# EAGLE design power_test (EAGLE 9.0.0)
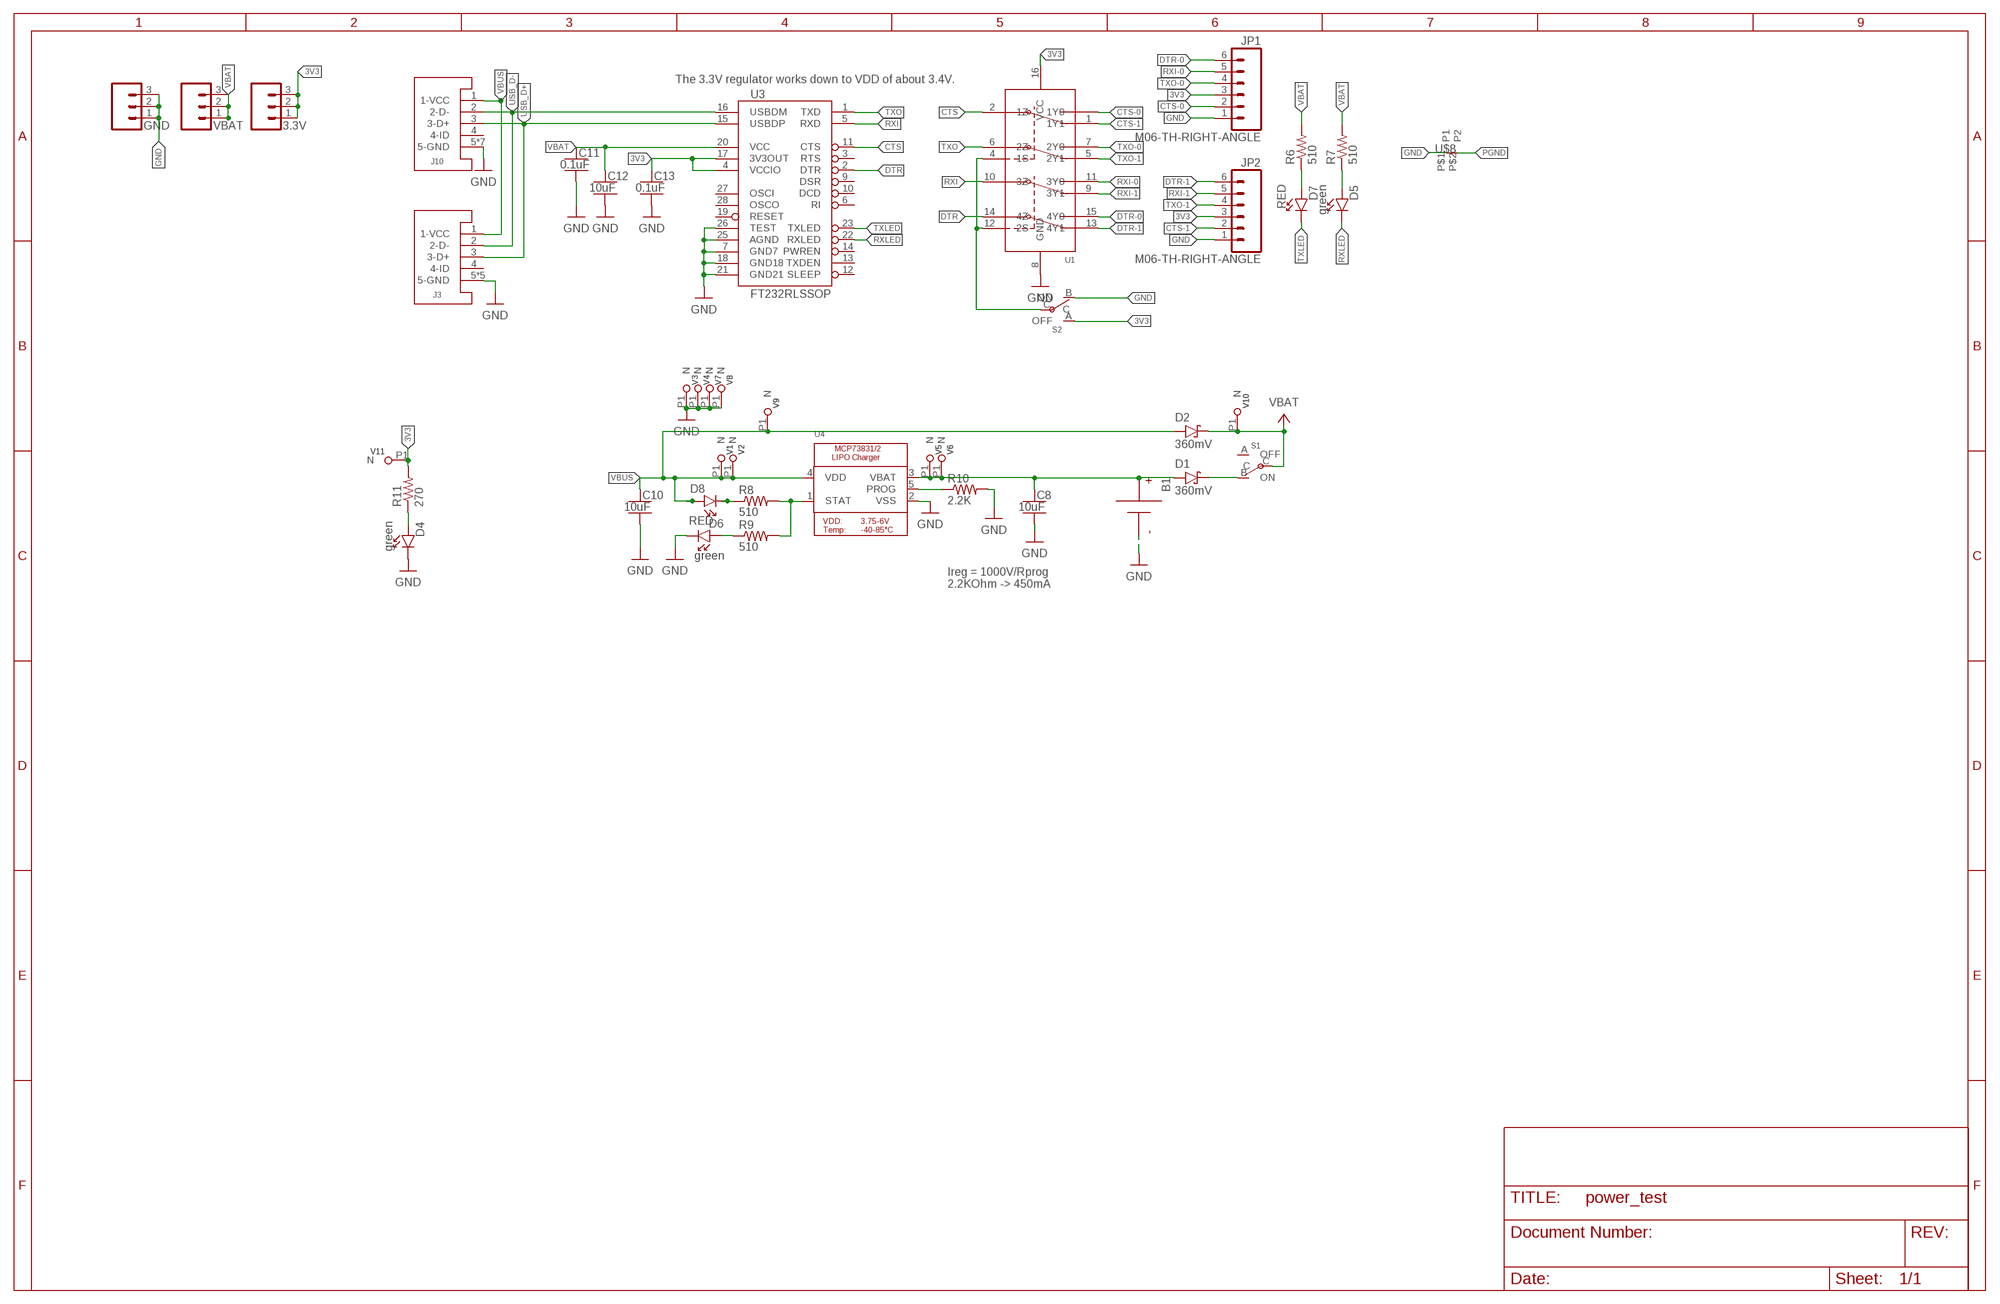
[diagram p0: schematic, sheet 1]
FRAME1 (FRAME_B_L): CREATOR: Unknown; DIST: Unknown; DISTPN: Unknown

## Parts
3.3V  HEADER-0.1IN-3POS-MALE  [HDRV3W63P254_3X1_762X254H838_HS]
B1  BATTERY  [BATTERY-TERMINALS]
C8  10uF  CAPACITOR-NP_SMD-2012-0805_CERAMIC-10UF  [CAPC2012X140_HS]
C10  10uF  CAPACITOR-NP_SMD-2012-0805_CERAMIC-10UF  [CAPC2012X140_HS]
C11  0.1uF  CAPACITOR-NP_SMD-2012-0805_CERAMIC-0.1UF  [CAPC2012X140_HS]
C12  10uF  CAPACITOR-NP_SMD-2012-0805_CERAMIC-10UF  [CAPC2012X140_HS]
C13  0.1uF  CAPACITOR-NP_SMD-2012-0805_CERAMIC-0.1UF  [CAPC2012X140_HS]
D1  360mV  DIODE-SCHOTTKY_SMD-SOD123-360MV  [SOD3716X135_HS]
D2  360mV  DIODE-SCHOTTKY_SMD-SOD123-360MV  [SOD3716X135_HS]
D4  green  DIODE-LED_SMD-2012-0805-GREEN  [LEDSC125X200X120-2_HS]
D5  green  DIODE-LED_SMD-2012-0805-GREEN  [LEDSC125X200X120-2_HS]
D6  green  DIODE-LED_SMD-2012-0805-GREEN  [LEDSC125X200X120-2_HS]
D7  RED  DIODE-LED_SMD-2012-0805-RED  [LEDSC125X200X120-2_HS]
D8  RED  DIODE-LED_SMD-2012-0805-RED  [LEDSC125X200X120-2_HS]
GND  HEADER-0.1IN-3POS-MALE  [HDRV3W63P254_3X1_762X254H838_HS]
J3  USB-MICROB-EDAC-690-005-299-043  [USB-MINIB-EDAC-690-005-299-043]
J10  USB-MICROA-AMPHENOL-10118192-0001LF  [USB-MICROA-10118192-0001LF]
JP1  M06-TH-RIGHT-ANGLE  [1X06-SIP-RIGHT-ANGLE]
JP2  M06-TH-RIGHT-ANGLE  [1X06-SIP-RIGHT-ANGLE]
R6  510  RESISTOR_SMD-2012-0805-510  [RESC2012X60_HS]
R7  510  RESISTOR_SMD-2012-0805-510  [RESC2012X60_HS]
R8  510  RESISTOR_SMD-2012-0805-510  [RESC2012X60_HS]
R9  510  RESISTOR_SMD-2012-0805-510  [RESC2012X60_HS]
R10  2.2K  RESISTOR_SMD-2012-0805-2.2K  [RESC2012X60_HS]
R11  270  RESISTOR_SMD-2012-0805-270  [RESC2012X60_HS]
S1  POWER-SWITCH-MFS201N-9-ZJS102011SAQN  [JS102011SAQN]
S2  POWER-SWITCH-MFS201N-9-ZJS102011SAQN  [JS102011SAQN]
U1  DPDT-X2  [SOP65P640X110-16]
U3  FT232RLSSOP  [SSOP28DB]
U4  MCP73831T-2ACI/OT  MCP73831/2  [SOT23-5]
U$8  NET_BRIDGE  [NET_BRIDGE]
V1  LOCKED-VIA-0.2  [VIA-0.2MM]
V2  LOCKED-VIA-0.2  [VIA-0.2MM]
V3  LOCKED-VIA-0.2  [VIA-0.2MM]
V4  LOCKED-VIA-0.2  [VIA-0.2MM]
V5  LOCKED-VIA-0.2  [VIA-0.2MM]
V6  LOCKED-VIA-0.2  [VIA-0.2MM]
V7  LOCKED-VIA-0.2  [VIA-0.2MM]
V8  LOCKED-VIA-0.2  [VIA-0.2MM]
V9  LOCKED-VIA-0.2  [VIA-0.2MM]
V10  LOCKED-VIA-0.2  [VIA-0.2MM]
V11  LOCKED-VIA-0.2  [VIA-0.2MM]
VBAT  HEADER-0.1IN-3POS-MALE  [HDRV3W63P254_3X1_762X254H838_HS]

## Nets
3V3 [HIGH-I]: 3.3V.1 3.3V.2 3.3V.3 C13.1 JP1.3 JP2.3 R11.2 S2.A(OFF) U1.16(VCC) U3.4(VCCIO) U3.17(3V3OUT) V11.P1(N)
BPOS [HIGH-I]: B1.+(P) C8.1 D1.A U4.3(VBAT) V5.P1(N) V6.P1(N)
CTS: U1.2(1Z) U3.11(CTS)
CTS-0: JP1.2 U1.3(1Y0)
CTS-1: JP2.2 U1.1(1Y1)
DTR: U1.14(4Z) U3.2(DTR)
DTR-0: JP1.6 U1.15(4Y0)
DTR-1: JP2.6 U1.13(4Y1)
GND [HIGH-I]: B1.-(N) C8.2 C10.2 C11.2 C12.2 C13.2 D4.C D6.C GND.1 GND.2 GND.3 J3.5(5-GND) J3.P6(5-GND) J3.P7(5-GND) J3.P8(5-GND) J3.P9(5-GND) J10.5(5-GND) J10.6(5-GND) J10.7(5-GND) J10.8(5-GND) J10.9(5-GND) J10.10(5-GND) J10.11(5-GND) JP1.1 JP2.1 R10.2 S2.B(ON) U1.8(GND) U3.7(GND7) U3.18(GND18) U3.21(GND21) U3.25(AGND) U3.26(TEST) U4.2(VSS) U$8.P$1(P1) V3.P1(N) V4.P1(N) V7.P1(N) V8.P1(N)
N$2: D7.A R6.1
N$3: D5.A R7.1
N$6: D8.C R8.1
N$11: R8.2 R9.2 U4.1(STAT)
N$12: R10.1 U4.5(PROG)
N$13: D6.A R9.1
N$14: D4.A R11.1
N$15 [HIGH-I]: D1.C S1.B(ON)
PGND: U$8.P$2(P2)
PROG_SEL: S2.C U1.4(1S) U1.12(2S)
RXI: U1.10(3Z) U3.5(RXD)
RXI-0: JP1.5 U1.11(3Y0)
RXI-1: JP2.5 U1.9(3Y1)
RXLED: D5.C U3.22(RXLED)
TXLED: D7.C U3.23(TXLED)
TXO: U1.6(2Z) U3.1(TXD)
TXO-0: JP1.4 U1.7(2Y0)
TXO-1: JP2.4 U1.5(2Y1)
USB_D+: J3.3(3-D+) J10.3(3-D+) U3.15(USBDP)
USB_D-: J3.2(2-D-) J10.2(2-D-) U3.16(USBDM)
VBAT [HIGH-I]: C11.1 C12.1 D2.C R6.2 R7.2 S1.C U3.20(VCC) V10.P1(N) VBAT.1 VBAT.2 VBAT.3
VBUS [HIGH-I]: C10.1 D2.A D8.A J3.1(1-VCC) J10.1(1-VCC) U4.4(VDD) V1.P1(N) V2.P1(N) V9.P1(N)
Unconnected: J3.4(4-ID) J10.4(4-ID) S1.A(OFF) U3.3(RTS) U3.6(RI) U3.9(DSR) U3.10(DCD) U3.12(SLEEP) U3.13(TXDEN) U3.14(PWREN) U3.19(RESET) U3.27(OSCI) U3.28(OSCO)

## Notes on the sheet
- The 3.3V regulator works down to VDD of about 3.4V.
- Ireg = 1000V/Rprog
  2.2KOhm -> 450mA

## Library data of the parts
3.3V GND VBAT = Components:HEADER-0.1IN-3POS: 3 pin single inline pin header, socket, or connector; DIST: Digikey; DISTPN: 3M9448-ND
B1 = quadparts_prebuilt:BATTERY; CREATOR: Swanson; DIST: NA; DISTPN: NA
C8 C10 C12 = quadparts_prebuilt:CAPACITOR-NP_: Nonpolarized capacitor; CREATOR: Swanson; DIST: Digikey; DISTPN: 445-14387-1-ND; MFR: TDK Corporation; MPN: C2012X5R1E106K085AC; REVIEWER: Swanson
C11 C13 = quadparts_prebuilt:CAPACITOR-NP_: Nonpolarized capacitor; CREATOR: Swanson; DIST: Digikey; DISTPN: 445-1418-1-ND; MFR: TDK; MPN: C2012X7R2A104K125AA; REVIEWER: Swanson
D1 D2 = quadparts_prebuilt:DIODE-SCHOTTKY_: Schottky diode; CREATOR: Swanson; DIST: Digikey; DISTPN: CRS08QMCT-ND; MFR: Toshiba Semiconductor and Storage; MPN: CRS08(TE85L,Q,M); REVIEWER: Swanson
D4-D6 = RemoteParts:DIODE-LED_: Light emitting diode; CREATOR: Swanson; DIST: Digikey; DISTPN: 160-1179-1-ND; MFR: Lite-On Inc; MPN: LTST-C170GKT; REVIEWER: Swanson
D7 D8 = RemoteParts:DIODE-LED_: Light emitting diode; CREATOR: Swanson; DIST: DIGIKEY; DISTPN: 160-1176-1-ND
J3 = RemoteParts:USB; CREATOR: Swanson; DIST: DIGIKEY; DISTPN: 151-1206-1-ND
J10 = RemoteParts:USB; CREATOR: Swanson; DIST: DIGIKEY; DISTPN: 609-4613-1-ND
JP1 JP2 = RemoteParts:M06: Header 6 Standard 6-pin 0.1" header. Use with straight break away headers (SKU : PRT-00116), right angle break away headers (PRT-00553), swiss pins (PRT-00743), machine pins (PRT-00117), and female headers (PRT-00115). Molex polarized connector foot print use with SKU : PRT-08094 with associated crimp pins and housings. NOTES ON THE VARIANTS LOCK and LOCK_LONGPADS... This footprint was designed to help hold the alignment of a through-hole component (i.e. 6-pin header) while soldering it into place. You may notice that each hole has been shifted either up or down by 0.005 of an inch from it's more standard position (which is a perfectly straight line). This slight alteration caused the pins (the squares in the middle) to touch the edges of the holes. Because they are alternating, it causes a "brace" to hold the component in place. 0.005 has proven to be the perfect amount of "off-center" position when using our standard breakaway headers. Although looks a little odd when you look at the bare footprint, once you have a header in there, the alteration is very hard to notice. Also, if you push a header all the way into place, it is covered up entirely on the bottom side. This idea of altering the position of holes to aid alignment will be further integrated into the Sparkfun Library for other footprints. It can help hold any component with 3 or more connection pins.
R6-R9 = quadparts_prebuilt:RESISTOR_: Resistor; DIST: DIGIKEY; DISTPN: 311-510ARCT-ND
R10 = quadparts_prebuilt:RESISTOR_: Resistor; DIST: DIGIKEY; DISTPN: YAG3776CT-ND
R11 = quadparts_prebuilt:RESISTOR_: Resistor; DIST: DIGIKEY; DISTPN: 311-270ARCT-ND
S1 S2 = RemoteParts:POWER-SWITCH-MFS201N-9-Z; CREATOR: Swanson; DIST: DIGIKEY; DISTPN: 401-1999-1-ND
U1 = RemoteParts:DPDT-X2; CREATOR: Swanson; DIST: DIGIKEY; DISTPN: 568-5300-1-ND
U3 = RemoteParts:FT232RL: USB UART FT232RL 4th Generation USB UART (USB <-> Serial) Controller. Spark Fun Electronics SKU : COM-00650; CREATOR: Swanson; DIST: DIGIKEY; DISTPN: 768-1007-1-ND
U4 = RemoteParts:MCP73831/2: MCP73831/2 LIPO Charger VDD: 3.75 - 6V Temp -40 - 85°C Programmable Charge Rate: 15-500mA NOTE: STAT is a tri-state logic output on the MCP73831 and an open-drain output on the MCP73832. SOT23-5 with 4.2V output and tri-state logic on STAT = MCP73831T-2ACI/OT; CREATOR: Adafruit; DIST: DIGIKEY; DISTPN: MCP73831T-2ACI/OTCT-ND
U$8 = custom:NET_BRIDGE; CREATOR: Michael Gonzalez; DIST: Nobody; DISTPN: 0; MFR: Digikey; MPN: 0
V1-V11 = quadparts_prebuilt:LOCKED-VIA; CREATOR: Swanson; DIST: NA; DISTPN: NA

## Net classes
1 HIGH-I: width 0.381 mm
2 RFSIG: width 0.457 mm

## Board
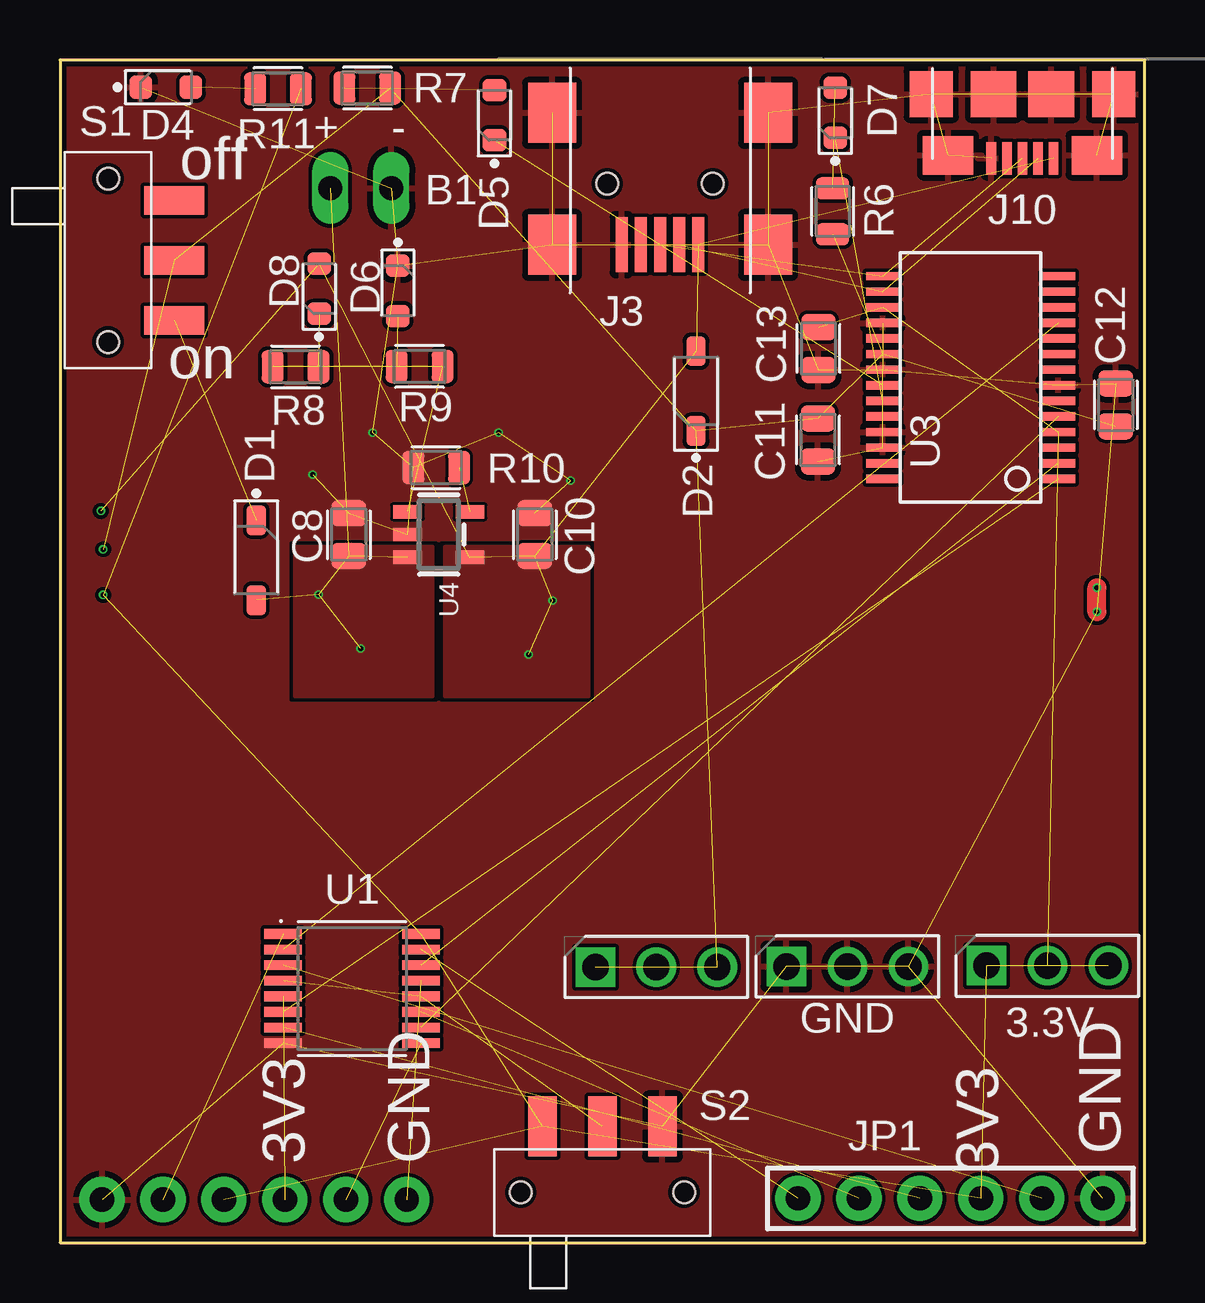
[diagram p1: board, top side]
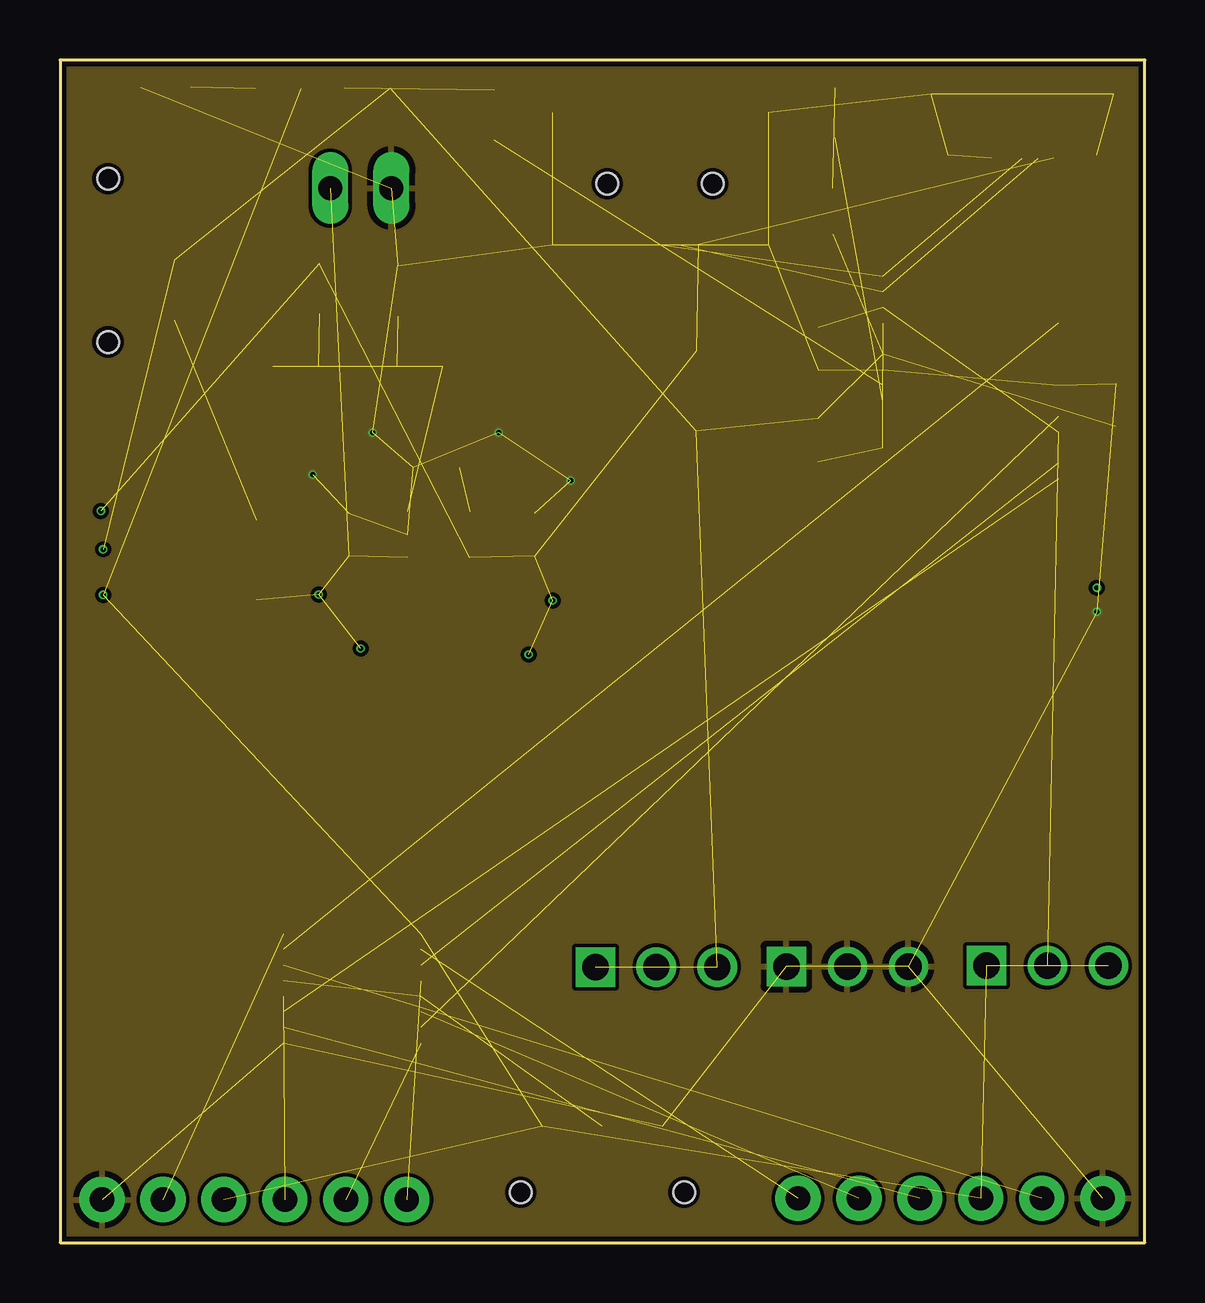
[diagram p2: board, inner layer Route2]
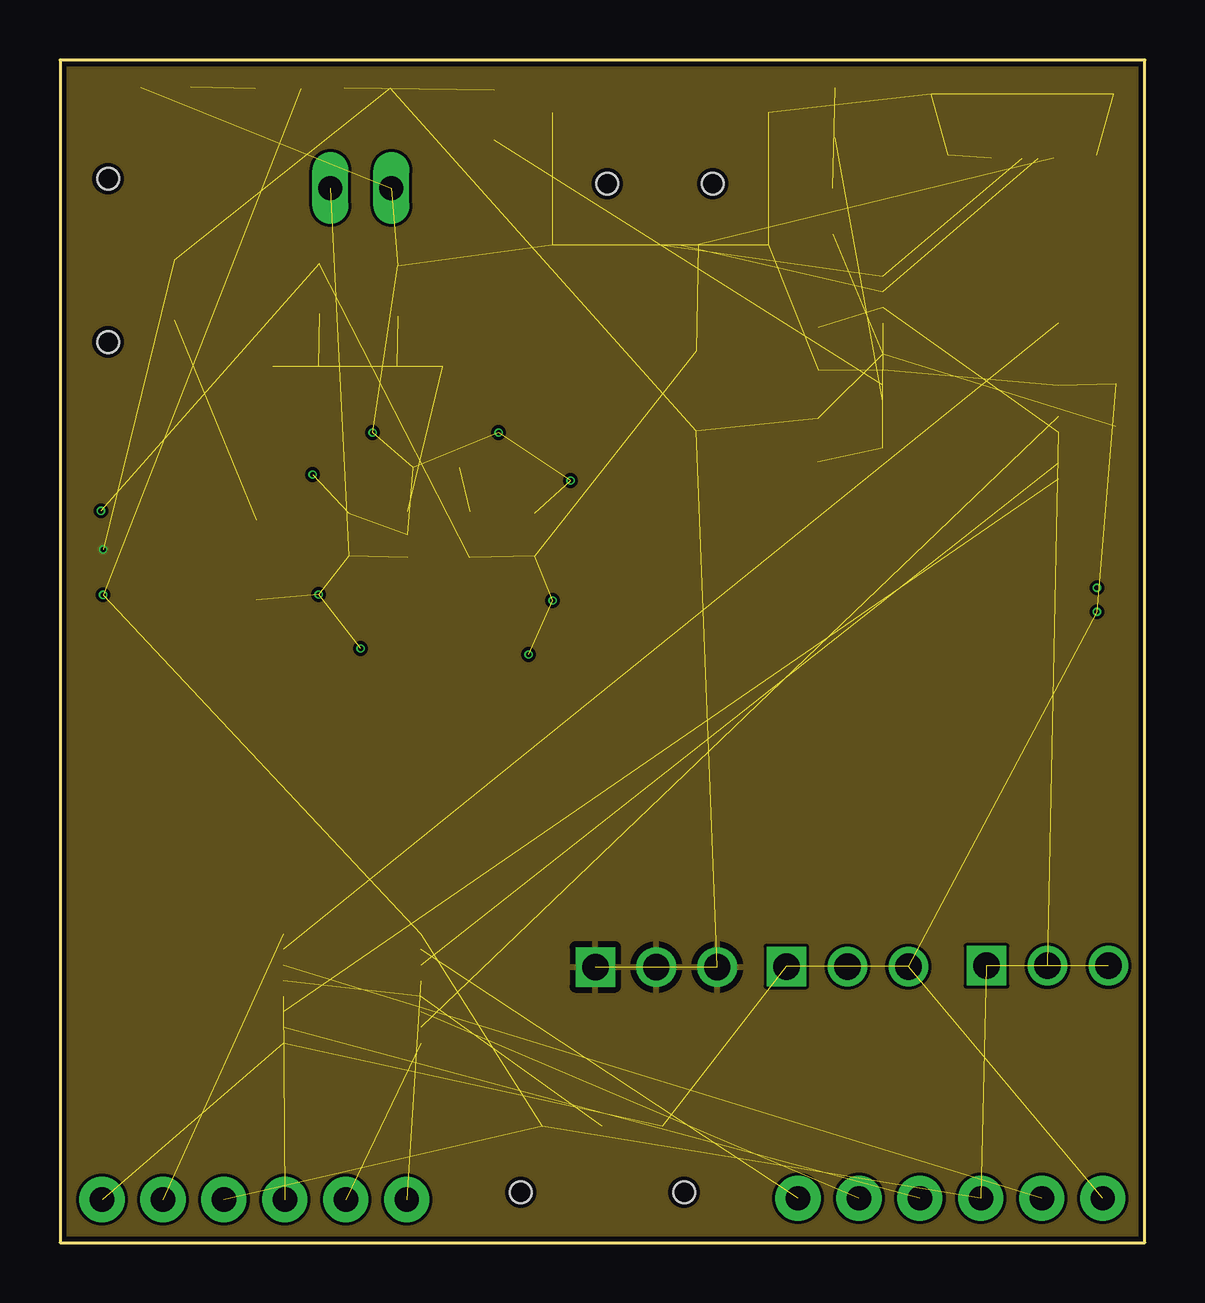
[diagram p3: board, inner layer Route15]
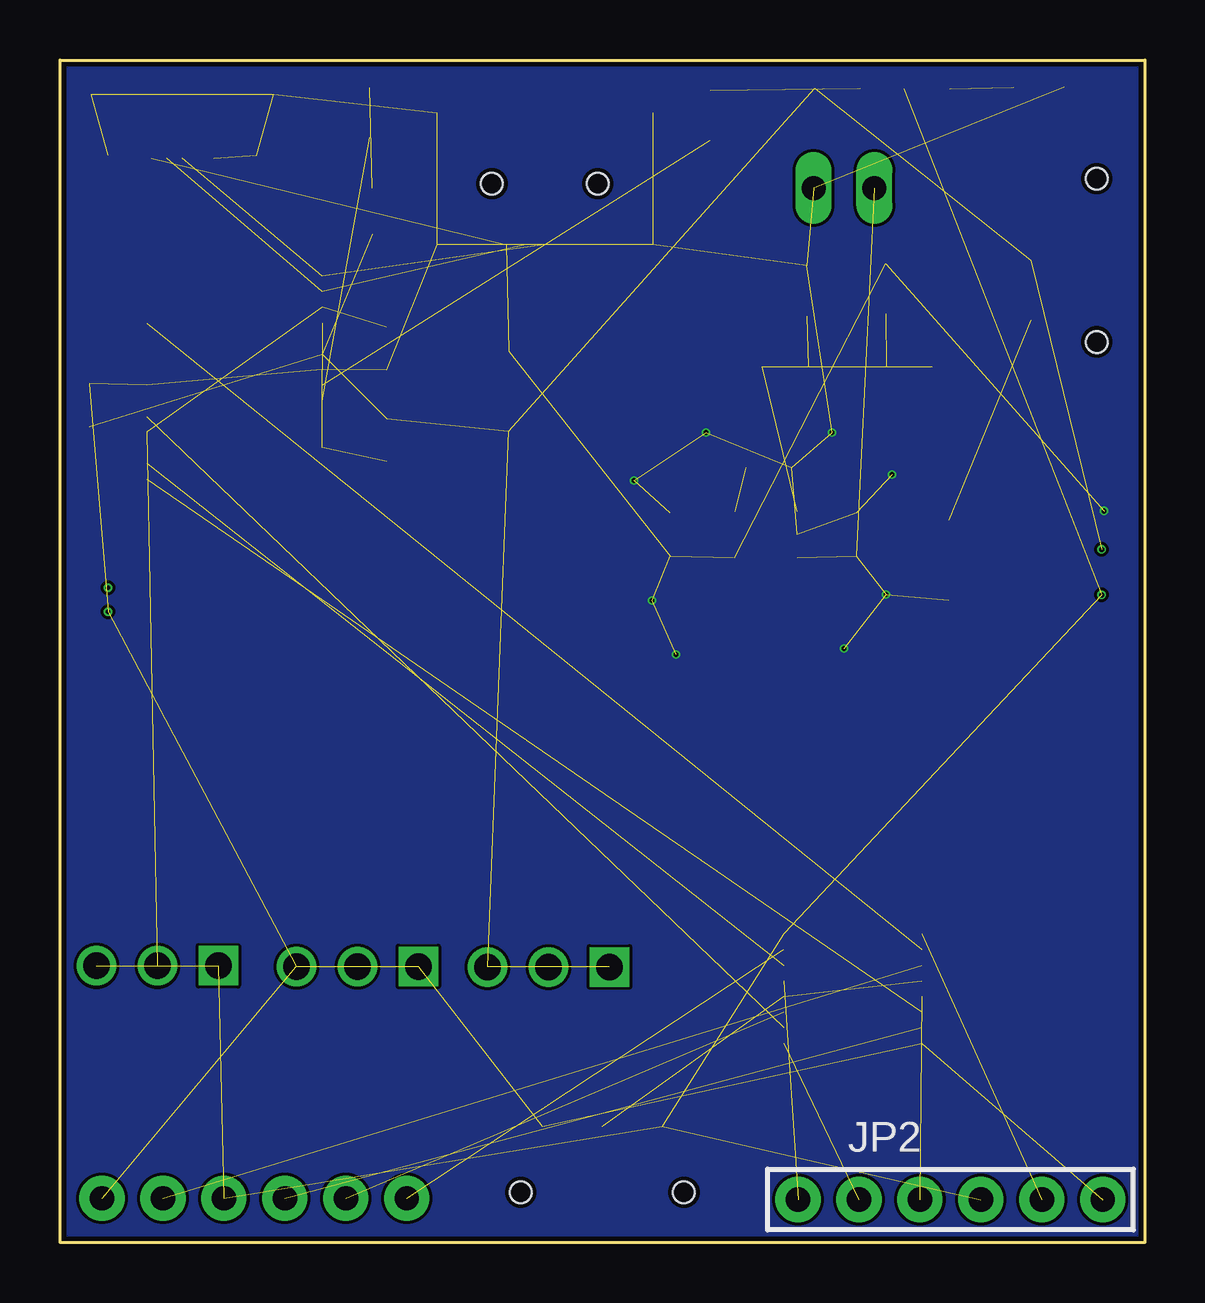
[diagram p4: board, bottom side, seen from below]

Size 45.2 x 49.3 mm. Coordinates in mm from the lower left corner, seen from the top.
Outline: 0,49.3 0,0 45.2,0 45.2,49.3 0,49.3
Copper layers (1*2*15*16): Top 0.035559375mm / dielectric 1.501140625mm / Route2 0.035559375mm / dielectric 0.149859375mm / Route15 0.035559375mm / dielectric 0.200659375mm / Bottom 0.035559375mm
Design rules "jlcpcb-4layer-5mil": minimum track width 5mil, minimum drill 0.2mm, track to track 5mil, track to pad 5mil, pad to pad 5mil, via to via 5mil, smd to smd 5mil, copper to edge 0.2mm, drill to drill 10mil, minimum pad ring 3mil, minimum via ring 5mil, stop-mask expansion 3mil, vias tented up to drill 0.45mm, thermal gap 10mil

### Footprints (pad centres in the part's own frame; a part is rotated, then mirrored left to right if it is on the bottom)
HDRV3W63P254_3X1_762X254H838_HS = drill 1.1 pad 1.65 square: 1 0,0 | drill 1.1 pad 1.65: 2 2.54,0; 3 5.08,0
BATTERY-TERMINALS = drill 1 long: + -1.27,-0.635; - 1.27,-0.635
CAPC2012X140_HS = smd 1.08 x 1.42: 1 -0.895,0; 2 0.895,0
SOD3716X135_HS = smd 1.25 x 0.8: A 1.665,0; C -1.665,0
LEDSC125X200X120-2_HS = smd 0.94 x 0.99: A -0.345,-0.9; C 1.745,-0.9
USB-MINIB-EDAC-690-005-299-043 = smd 2.3 x 0.5: 1 5.5,1.6; 2 5.5,0.8; 3 5.5,0; 4 5.5,-0.8; 5 5.5,-1.6 | smd 2.5 x 2: P6 5.5,-4.5; P7 5.5,4.5; P8 0,4.5; P9 0,-4.5 | hole 0.9: 2.95,2.2; 2.95,-2.2
USB-MICROA-10118192-0001LF = smd 0.4 x 1.35: 1 -1.3,0; 2 -0.65,0; 3 0,0; 4 0.65,0; 5 1.3,0 | smd 2.1 x 1.6: 6 3.1,-0.125; 7 -3.1,-0.125 | smd 1.8 x 1.9: 8 -3.8,-2.675; 11 3.8,-2.675 | smd 1.9 x 1.9: 9 1.2,-2.675; 10 -1.2,-2.675
1X06-SIP-RIGHT-ANGLE = drill 1.016 pad 1.88: 1 -6.35,0; 2 -3.81,0; 3 -1.27,0; 4 1.27,0; 5 3.81,0; 6 6.35,0
RESC2012X60_HS = smd 0.92 x 1.38: 1 -0.955,0; 2 0.955,0
JS102011SAQN = smd 1.2 x 2.5: A -2.5,2.75; B 2.5,2.75; C 0,2.75 | hole 0.9: 3.4,0; -3.4,0
SOP65P640X110-16 = smd 1.572 x 0.407: 1 -2.872,2.275; 2 -2.872,1.625; 3 -2.872,0.975; 4 -2.872,0.325; 5 -2.872,-0.325; 6 -2.872,-0.975; 7 -2.872,-1.625; 8 -2.872,-2.275; 9 2.872,-2.275; 10 2.872,-1.625; 11 2.872,-0.975; 12 2.872,-0.325; 13 2.872,0.325; 14 2.872,0.975; 15 2.872,1.625; 16 2.872,2.275
SSOP28DB = smd 0.348 x 1.397: 1 -4.225,-3.656; 2 -3.575,-3.656; 3 -2.925,-3.656; 4 -2.275,-3.656; 5 -1.625,-3.656; 6 -0.975,-3.656; 7 -0.325,-3.656; 8 0.325,-3.656; 9 0.975,-3.656; 10 1.625,-3.656; 11 2.275,-3.656; 12 2.925,-3.656; 13 3.575,-3.656; 14 4.225,-3.656; 15 4.225,3.656; 16 3.575,3.656; 17 2.925,3.656; 18 2.275,3.656; 19 1.625,3.656; 20 0.975,3.656; 21 0.325,3.656; 22 -0.325,3.656; 23 -0.975,3.656; 24 -1.625,3.656; 25 -2.275,3.656; 26 -2.925,3.656; 27 -3.575,3.656; 28 -4.225,3.656
SOT23-5 = smd 0.55 x 1.2: 1 -0.95,-1.3; 2 0,-1.3; 3 0.95,-1.3; 4 0.95,1.3; 5 -0.95,1.3
NET_BRIDGE = drill 0.2: P$1 -0.5,0; P$2 0.5,0
VIA-0.2MM = drill 0.2 pad 0.3: P1 0,0

### Placement (x,y rotation side)
3.3V  38.6,11.54 0 top
B1  12.53,44.6 0 top
C8  12.03,29.52 90 top
C10  19.78,29.52 90 top
C11  31.58,33.46 270 top
C12  43.99,34.92 90 top
C13  31.6,37.27 270 top
D1  8.18,28.45 270 top
D2  26.5,35.5 90 top
D4  5.11,47.26 180 top
D5  19,47.7 270 top
D6  13.18,38.97 90 top
D7  33.2,47.8 270 top
D8  11.7,40.47 270 top
GND  30.27,11.51 0 top
J3  25,47.1 270 top
J10  40.1,45.2 180 top
JP1  37.1,1.85 180 top
JP2  8.1,1.8 180 bottom
R6  32.2,42.99 270 top
R7  12.8,48.13 0 top
R8  9.81,36.51 180 top
R9  14.99,36.53 0 top
R10  15.68,32.31 180 top
R11  9.08,48.1 0 top
S1  2,40.95 270 top
S2  22.6,2.1 0 top
U1  12.17,10.6 0 top
U3  37.94,36.07 90 top
U4  15.78,29.52 270 top
U$8  43.2,26.8 90 top
V1  20.53,26.77 0 top
V2  19.53,24.52 0 top
V3  10.53,32.02 0 top
V4  13.03,33.77 0 top
V5  10.78,27.02 0 top
V6  12.53,24.77 0 top
V7  18.28,33.77 0 top
V8  21.28,31.77 0 top
V9  1.7,30.5 0 top
V10  1.8,28.9 0 top
V11  1.8,27 0 top
VBAT  22.3,11.49 0 top

### Tracks (layer width: path | path; a pad name or v marks a point on that pad's centre or on a via)
3V3  (11 unrouted)
BPOS  (5 unrouted)
  pour Top (no thermals): 15.53,29.02 9.78,29.02 9.78,22.77 15.53,22.77
  pour Bottom: 15.53,29.02 9.78,29.02 9.78,22.77 15.53,22.77
CTS  (1 unrouted)
CTS-0  (1 unrouted)
CTS-1  (1 unrouted)
DTR  (1 unrouted)
DTR-0  (1 unrouted)
DTR-1  (1 unrouted)
GND  (38 unrouted)
  pour Route2 (isolate 0.152, rank 6): 92.5,57.55 134.1,57.45 146,57.45 146,-64.55 -0.1,-63.15 -0.1,57.55
  pour Bottom: 9.78,29.27 9.78,35.02 22.03,35.02 22.03,29.27
  pour Top (no thermals): 9.73,29.32 9.73,34.12 22.03,34.12 22.03,29.32
  pour Top (isolate 0.152, rank 6): 92.5,58.45 134.1,58.45 147,58.45 147,-65.55 -2.5,-65.55 -2.5,58.45
N$2  (1 unrouted)
N$3  (1 unrouted)
N$6  (1 unrouted)
N$11  (2 unrouted)
N$12  (1 unrouted)
N$13  (1 unrouted)
N$14  (1 unrouted)
N$15  (1 unrouted)
PROG_SEL  (2 unrouted)
RXI  (1 unrouted)
RXI-0  (1 unrouted)
RXI-1  (1 unrouted)
RXLED  (1 unrouted)
TXLED  (1 unrouted)
TXO  (1 unrouted)
TXO-0  (1 unrouted)
TXO-1  (1 unrouted)
USB_D+  (2 unrouted)
USB_D-  (2 unrouted)
VBAT  (10 unrouted)
  pour Route15 (rank 2): -3.25,58.7 134.1,58.7 147.75,58.7 147.75,-66.8 -3.25,-66.8
VBUS  (8 unrouted)
  pour Top (no thermals): 16.03,29.02 22.03,29.02 22.03,22.77 16.03,22.77
  pour Bottom: 16.03,29.02 22.03,29.02 22.03,22.77 16.03,22.77
  pour Bottom: -0.1,50.5 48,50.5 48,-3.8 -1.2,-3.8 -1.2,50.6 -0.1,50.6

### Text on the board
tPlace: off | on | 3V3 | GND | 3V3 | GND
Document: Todo / / * Run at 3.3V and reconnect FTDI pins and programmer pins. / * Add FTDI chip w/ jumper to disable. / * Add N-pin connector so you can program the quad with the on-board FTDI / * Add Lipo charger. / * lower serial display and wrap controller more tightlight around it. / * See if we can make the board as narrow as the LCD. Maybe removinng the breakout area.